# EAGLE schematic regulator_schematic (EAGLE 9.6.2)
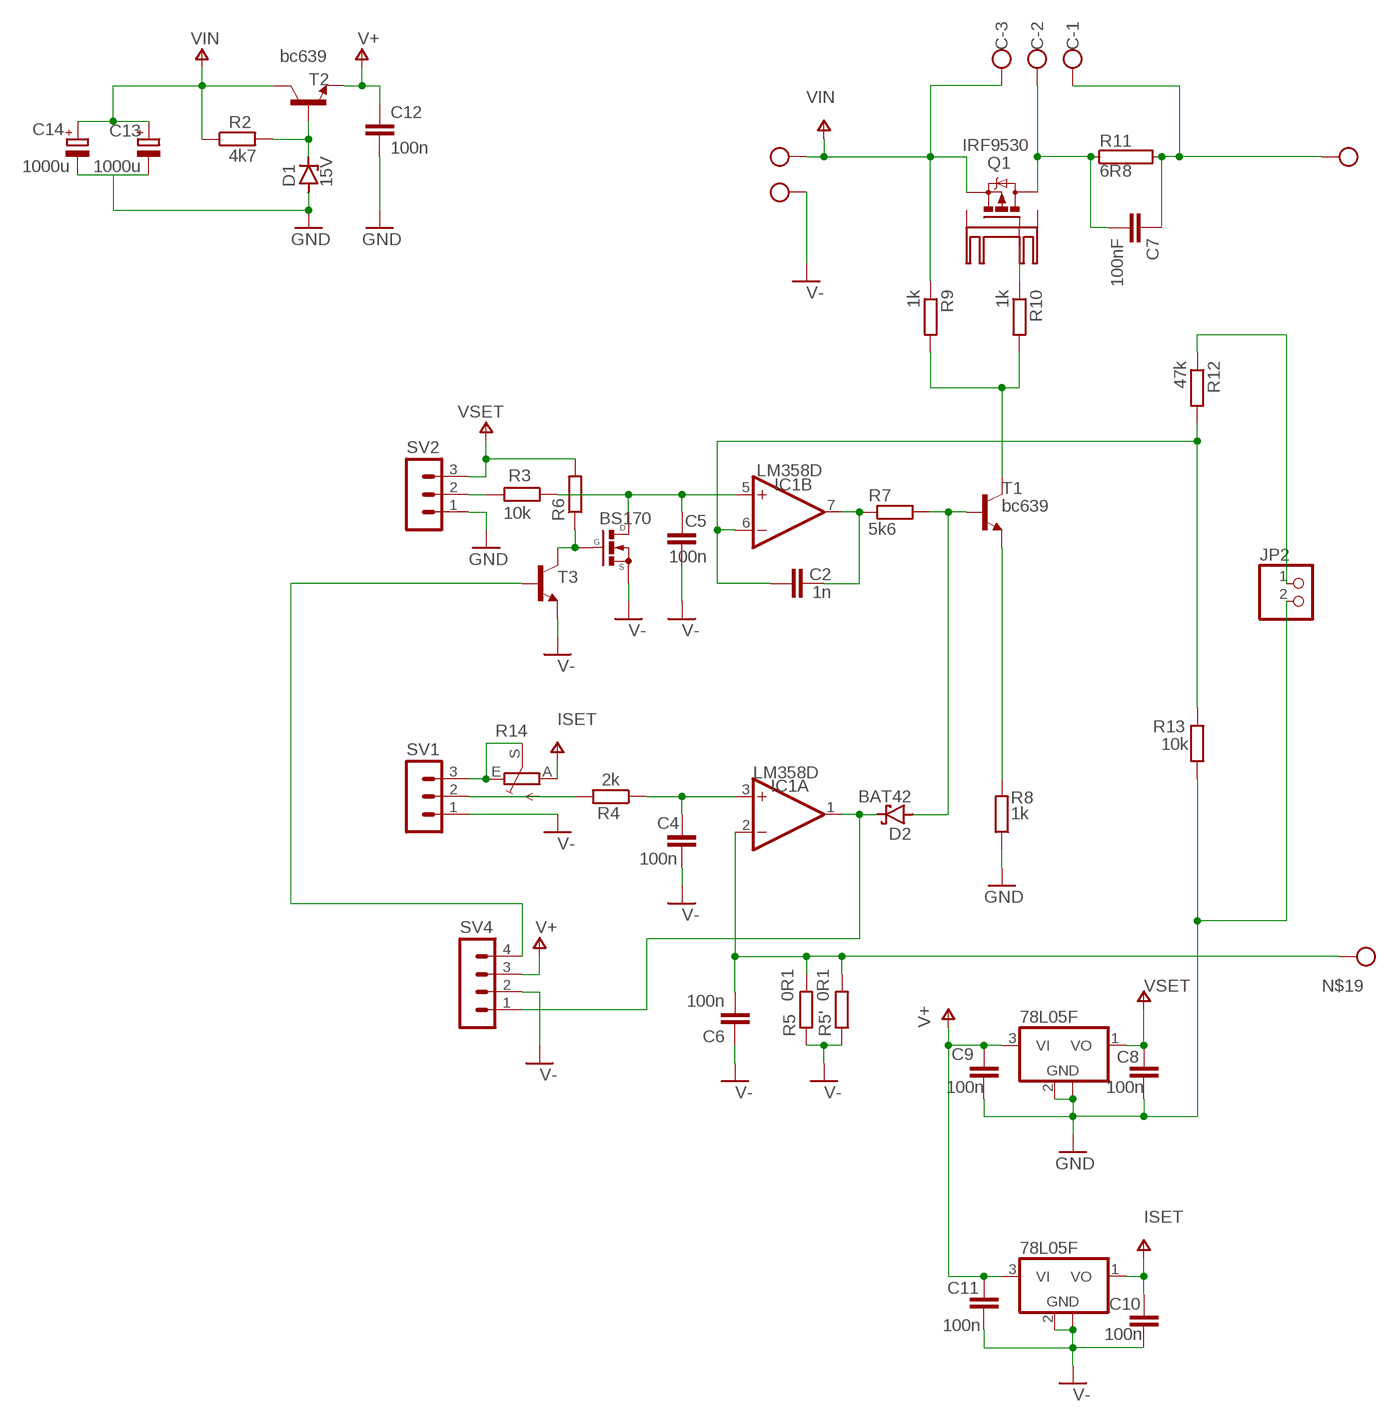
[diagram p0: schematic, sheet 1]

## Parts
C  W237-103  [W237-103]
C2  1n  C-EUC0805  [C0805]
C4  100n  C-EUC0805  [C0805]
C5  100n  C-EUC0805  [C0805]
C6  100n  C-EUC0805  [C0805]
C7  100nF  C-EUC0805  [C0805]
C8  100n  C-EUC0805  [C0805]
C9  100n  C-EUC0805  [C0805]
C10  100n  C-EUC0805  [C0805]
C11  100n  C-EUC0805  [C0805]
C12  100n  C-EU075-032X103  [C075-032X103]
C13  1000u  CPOL-EUE7.5-16  [E7,5-16]
C14  1000u  CPOL-EUE7.5-16  [E7,5-16]
D1  15V  ZENER-DIODEDO34-7  [DO34Z7]
D2  BAT42  [DO35-10]
IC1  LM358D  [SO08]
IC2  78L05F  [SOT89]
IC3  78L05F  [SOT89]
JP2  PINHD-1X2  [1X02]
KK1  SK104-PAD  [SK104-PAD]
Q1  IRF9530  [TO220BV]
Q3  BS170  [SOT54ES]
R2  4k7  R-EU_R0805  [R0805]
R3  10k  R-EU_R0805  [R0805]
R4  2k  R-EU_0204/7  [0204/7]
R5  0R1  R-EU_VTA52  [VTA52]
R5'  0R1  R-EU_VTA52  [VTA52]
R6  R-EU_R0805  [R0805]
R7  5k6  R-EU_0204/7  [0204/7]
R8  1k  R-EU_R0805  [R0805]
R9  1k  R-EU_0204/7  [0204/7]
R10  1k  R-EU_0204/7  [0204/7]
R11  6R8  RMNS-5  [MNS-5]
R12  47k  R-EU_R0805  [R0805]
R13  10k  R-EU_R0805  [R0805]
R14  TRIM_EU-B64Y  [B64Y]
SV1  MA03-1  [MA03-1]
SV2  MA03-1  [MA03-1]
SV4  MA04-1  [MA04-1]
T1  bc639  BC639-NPN-TO92-ECB  [TO92-ECB]
T2  bc639  BC639-NPN-TO92-ECB  [TO92-ECB]
T3  BC817-16-NPN-SOT23-BEC  [SOT23-BEC]
X1  W237-102  [W237-102]
X2  W237-102  [W237-102]

## Nets
GND: C8.1 C9.1 IC2.2(GND) IC2.2@1(GND) JP2.2 R13.2 SV2.1
ISET: C10.2 IC3.1(VO) R14.A ; supply symbol labelled V+
N$1: D2.C IC1.1(A:OUT) SV4.1
N$2: C5.2 IC1.5(B:+IN) Q3.D R3.1
N$3: C4.2 IC1.3(A:+IN) R4.1
N$4: C2.2 IC1.7(B:OUT) R7.1
N$5: D2.A R7.2 T1.B
N$6: R8.2 T1.E
N$7: C2.1 IC1.6(B:-IN) R12.2 R13.1
N$8: R3.2 SV2.2
N$9: C7.2 C.2 Q1.D R11.1
N$10: C7.1 C.1 R11.2 X1.2
N$11: R14.E R14.S SV1.3
N$12: R4.2 SV1.2
N$13: D1.C R2.2 T2.B
N$14: Q3.G R6.1 T3.C
N$15: Q1.G R10.1
N$16: SV4.4 T3.B
N$17: R9.2 R10.2 T1.C
N$18: JP2.1 R12.1
N$19: C6.2 IC1.2(A:-IN) R5'.2 R5.2 X1.1
V+: C9.2 C11.2 C12.1 IC2.3(VI) IC3.3(VI) SV4.3 T2.E
V-: C4.1 C5.1 C6.1 C10.1 C11.1 C12.2 C13.- C14.- D1.A IC3.2(GND) IC3.2@1(GND) Q3.S R5'.1 R5.1 R8.1 SV1.1 SV4.2 T3.E X2.2 ; supply symbol labelled GND
VIN: C13.+ C14.+ C.3 Q1.S R2.1 R9.1 T2.C X2.1 ; supply symbol labelled V+
VSET: C8.2 IC2.1(VO) R6.2 SV2.3 ; supply symbol labelled V+
Unconnected: KK1.K1(K) KK1.K2(K)

## Power pins joined to a net without a drawn wire
V+: IC1.8(P:V+)
V-: IC1.4(P:V-)

## Library data of the parts
C = con-wago-500:W237-103: WAGO SCREW CLAMP; MPN: 237-103; OC_FARNELL: unknown; OC_NEWARK: 18M7116
C2 C4-C12 = rcl:C-EU: CAPACITOR, European symbol; SPICEPREFIX: C
C13 C14 = rcl:CPOL-EU: POLARIZED CAPACITOR, European symbol; SPICEPREFIX: C
D1 = diode:ZENER-DIODE: Z-Diode
D2 = diode:BAT42: DIODE barrier diode
IC1 = linear:LM358: OP AMP also LM158; LM258; LM2904 Source: http://cache.national.com/ds/LM/LM158.pdf
IC2 IC3 = linear:78L*: POSITOIV-VOLTAGE REGULATORS Output up to 100 mA Source: Datasheet <http://focus.ti.com/lit/ds/symlink/ua78l05.pdf>
JP2 = pinhead:PINHD-1X2: PIN HEADER
KK1 = heatsink:SK104-PAD: HEATSINK manufacturer Fischer/distributor Buerklin
Q1 = transistor-power:IRF9530: P-CHANNEL HEXFET POWER-MOS-FET Source: http://www.irf.com/product-info/datasheets/data/irf9530.pdf
Q3 = BS170:BS170: N-CHANNEL MOS FET Check prices <https://pricing.snapeda.com/parts/BS170/ON%20Semiconductor/view-part?ref=eda>; AVAILABILITY: In Stock; DESCRIPTION: N-Channel 60V 500mA (Ta) 830mW (Ta) Through Hole TO-92-3; MF: ON Semiconductor; MP: BS170; PACKAGE: TO-92 NTE Electronics; PRICE: None
R2-R5 R5' R6-R10 R12 R13 = rcl:R-EU_: RESISTOR, European symbol; SPICEPREFIX: R
R11 = resistor-power:R: Power Resitor; OC_FARNELL: unknown; OC_NEWARK: unknown
R14 = pot:TRIM_EU-: POTENTIOMETER
SV1 SV2 = con-lstb:MA03-1: PIN HEADER; OC_FARNELL: unknown; OC_NEWARK: unknown
SV4 = con-lstb:MA04-1: PIN HEADER; OC_FARNELL: unknown; OC_NEWARK: unknown
T1-T3 = transistor:*-NPN-: NPN Transistror BF959 corrected 2008.03.06
X1 X2 = con-wago-500:W237-102: WAGO SCREW CLAMP; MPN: 237-102; OC_FARNELL: unknown; OC_NEWARK: 70K9898